# EAGLE design driver (EAGLE 5.11)
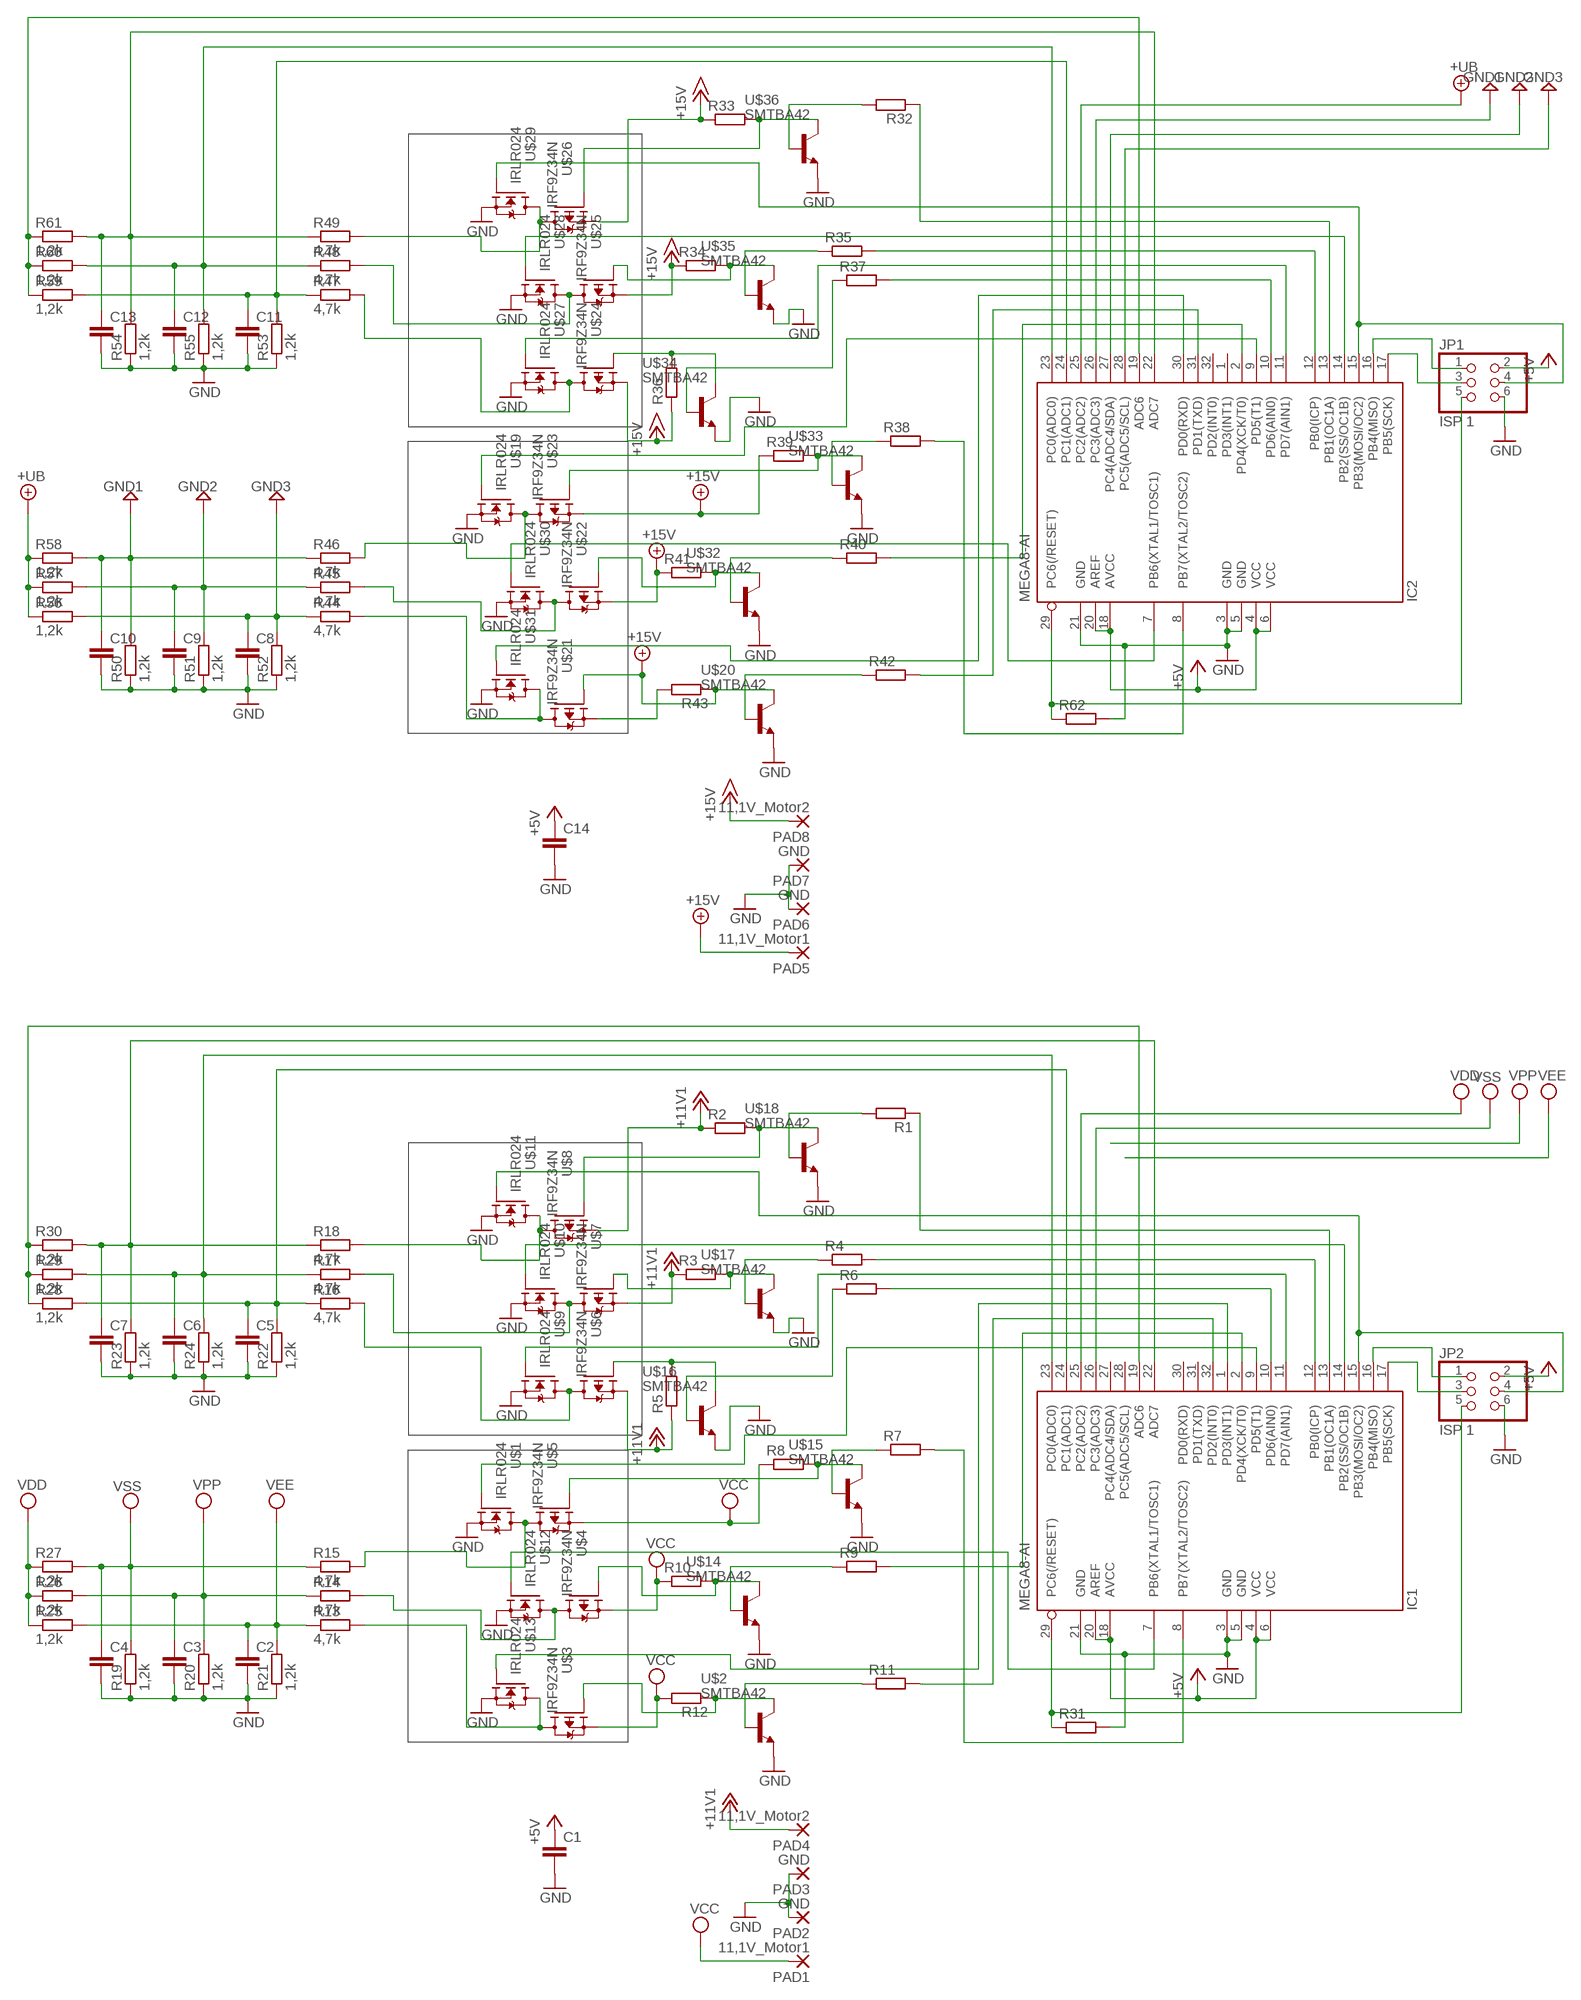
[diagram p0: schematic, sheet 1]

## Parts
C1  C-EUC0805  [C0805]
C2  C-EUC0805  [C0805]
C3  C-EUC0805  [C0805]
C4  C-EUC0805  [C0805]
C5  C-EUC0805  [C0805]
C6  C-EUC0805  [C0805]
C7  C-EUC0805  [C0805]
C8  C-EUC0805  [C0805]
C9  C-EUC0805  [C0805]
C10  C-EUC0805  [C0805]
C11  C-EUC0805  [C0805]
C12  C-EUC0805  [C0805]
C13  C-EUC0805  [C0805]
C14  C-EUC0805  [C0805]
IC1  MEGA8-AI  [TQFP32-08]
IC2  MEGA8-AI  [TQFP32-08]
JP1  ISP 1  PINHD-2X3  [2X03]
JP2  ISP 1  PINHD-2X3  [2X03]
PAD1  11,1V_Motor1  3,17/1,3  [3,17/1,3]
PAD2  GND  3,17/1,3  [3,17/1,3]
PAD3  GND  3,17/1,3  [3,17/1,3]
PAD4  11,1V_Motor2  3,17/1,3  [3,17/1,3]
PAD5  11,1V_Motor1  3,17/1,3  [3,17/1,3]
PAD6  GND  3,17/1,3  [3,17/1,3]
PAD7  GND  3,17/1,3  [3,17/1,3]
PAD8  11,1V_Motor2  3,17/1,3  [3,17/1,3]
R1  R-EU_M0805  [M0805]
R2  R-EU_0204/5  [0204/5]
R3  R-EU_0204/5  [0204/5]
R4  R-EU_M0805  [M0805]
R5  R-EU_0204/5  [0204/5]
R6  R-EU_M0805  [M0805]
R7  R-EU_M0805  [M0805]
R8  R-EU_0204/5  [0204/5]
R9  R-EU_M0805  [M0805]
R10  R-EU_0204/5  [0204/5]
R11  R-EU_M0805  [M0805]
R12  R-EU_0204/5  [0204/5]
R13  4,7k  R-EU_M0805  [M0805]
R14  4,7k  R-EU_M0805  [M0805]
R15  4,7k  R-EU_M0805  [M0805]
R16  4,7k  R-EU_M0805  [M0805]
R17  4,7k  R-EU_M0805  [M0805]
R18  4,7k  R-EU_M0805  [M0805]
R19  1,2k  R-EU_M0805  [M0805]
R20  1,2k  R-EU_M0805  [M0805]
R21  1,2k  R-EU_M0805  [M0805]
R22  1,2k  R-EU_M0805  [M0805]
R23  1,2k  R-EU_M0805  [M0805]
R24  1,2k  R-EU_M0805  [M0805]
R25  1,2k  R-EU_M0805  [M0805]
R26  1,2k  R-EU_M0805  [M0805]
R27  1,2k  R-EU_M0805  [M0805]
R28  1,2k  R-EU_M0805  [M0805]
R29  1,2k  R-EU_M0805  [M0805]
R30  1,2k  R-EU_M0805  [M0805]
R31  R-EU_M0805  [M0805]
R32  R-EU_M0805  [M0805]
R33  R-EU_0204/5  [0204/5]
R34  R-EU_0204/5  [0204/5]
R35  R-EU_M0805  [M0805]
R36  R-EU_0204/5  [0204/5]
R37  R-EU_M0805  [M0805]
R38  R-EU_M0805  [M0805]
R39  R-EU_0204/5  [0204/5]
R40  R-EU_M0805  [M0805]
R41  R-EU_0204/5  [0204/5]
R42  R-EU_M0805  [M0805]
R43  R-EU_0204/5  [0204/5]
R44  4,7k  R-EU_M0805  [M0805]
R45  4,7k  R-EU_M0805  [M0805]
R46  4,7k  R-EU_M0805  [M0805]
R47  4,7k  R-EU_M0805  [M0805]
R48  4,7k  R-EU_M0805  [M0805]
R49  4,7k  R-EU_M0805  [M0805]
R50  1,2k  R-EU_M0805  [M0805]
R51  1,2k  R-EU_M0805  [M0805]
R52  1,2k  R-EU_M0805  [M0805]
R53  1,2k  R-EU_M0805  [M0805]
R54  1,2k  R-EU_M0805  [M0805]
R55  1,2k  R-EU_M0805  [M0805]
R56  1,2k  R-EU_M0805  [M0805]
R57  1,2k  R-EU_M0805  [M0805]
R58  1,2k  R-EU_M0805  [M0805]
R59  1,2k  R-EU_M0805  [M0805]
R60  1,2k  R-EU_M0805  [M0805]
R61  1,2k  R-EU_M0805  [M0805]
R62  R-EU_M0805  [M0805]
U$1  IRLR024  [TO252]
U$2  SMTBA42  [SOT23-BEC]
U$3  IRF9Z34N  [TO220V]
U$4  IRF9Z34N  [TO220V]
U$5  IRF9Z34N  [TO220V]
U$6  IRF9Z34N  [TO220V]
U$7  IRF9Z34N  [TO220V]
U$8  IRF9Z34N  [TO220V]
U$9  IRLR024  [TO252]
U$10  IRLR024  [TO252]
U$11  IRLR024  [TO252]
U$12  IRLR024  [TO252]
U$13  IRLR024  [TO252]
U$14  SMTBA42  [SOT23-BEC]
U$15  SMTBA42  [SOT23-BEC]
U$16  SMTBA42  [SOT23-BEC]
U$17  SMTBA42  [SOT23-BEC]
U$18  SMTBA42  [SOT23-BEC]
U$19  IRLR024  [TO252]
U$20  SMTBA42  [SOT23-BEC]
U$21  IRF9Z34N  [TO220V]
U$22  IRF9Z34N  [TO220V]
U$23  IRF9Z34N  [TO220V]
U$24  IRF9Z34N  [TO220V]
U$25  IRF9Z34N  [TO220V]
U$26  IRF9Z34N  [TO220V]
U$27  IRLR024  [TO252]
U$28  IRLR024  [TO252]
U$29  IRLR024  [TO252]
U$30  IRLR024  [TO252]
U$31  IRLR024  [TO252]
U$32  SMTBA42  [SOT23-BEC]
U$33  SMTBA42  [SOT23-BEC]
U$34  SMTBA42  [SOT23-BEC]
U$35  SMTBA42  [SOT23-BEC]
U$36  SMTBA42  [SOT23-BEC]

## Nets
+5V: C1.1 C14.1 IC1.4(VCC) IC1.6(VCC) IC1.18(AVCC) IC1.20(AREF) IC2.4(VCC) IC2.6(VCC) IC2.18(AVCC) IC2.20(AREF) JP1.2 JP2.2
+12V: PAD4.1(P) R2.1 R3.1 R5.1 U$6.3(S) U$7.3(S) U$8.3(S) ; supply symbol labelled +11V1
+15V: PAD5.1(P) PAD8.1(P) R33.1 R34.1 R36.1 R39.1 R41.1 R43.1 U$20.C U$21.1(G) U$22.3(S) U$23.3(S) U$24.3(S) U$25.3(S) U$26.3(S)
+UB: IC2.25(PC2(ADC2)) R56.1 R57.1 R58.1
GND: C1.2 C2.2 C3.2 C4.2 C5.2 C6.2 C7.2 C8.2 C9.2 C10.2 C11.2 C12.2 C13.2 C14.2 IC1.3(GND) IC1.5(GND) IC1.21(GND) IC2.3(GND) IC2.5(GND) IC2.21(GND) JP1.6 JP2.6 PAD2.1(P) PAD3.1(P) PAD6.1(P) PAD7.1(P) R19.1 R20.1 R21.1 R22.1 R23.1 R24.1 R31.2 R50.1 R51.1 R52.1 R53.1 R54.1 R55.1 R62.2 U$1.2(S) U$2.E U$9.2(S) U$10.2(S) U$11.2(S) U$12.2(S) U$13.2(S) U$14.E U$15.E U$16.E U$17.E U$18.E U$19.2(S) U$20.E U$27.2(S) U$28.2(S) U$29.2(S) U$30.2(S) U$31.2(S) U$32.E U$33.E U$34.E U$35.E U$36.E
GND1: C10.1 IC2.26(PC3(ADC3)) R46.1 R50.2 R58.2
GND2: C9.1 IC2.27(PC4(ADC4/SDA)) R45.1 R51.2 R57.2
GND3: C8.1 IC2.28(PC5(ADC5/SCL)) R44.1 R52.2 R56.2
N$1: R16.2 U$6.2(D) U$9.3(D)
N$2: IC1.16(PB4(MISO)) JP2.1
N$3: C5.1 IC1.24(PC1(ADC1)) R16.1 R22.2 R28.2
N$4: IC1.15(PB3(MOSI/OC2)) JP2.4 U$11.1(G)
N$5: IC1.14(PB2(SS/OC1B)) U$10.1(G)
N$6: IC1.13(PB1(OC1A)) R1.1
N$7: R12.1 U$2.C U$3.1(G)
N$8: R8.2 U$5.1(G) U$15.C
N$9: R10.2 U$4.1(G) U$14.C
N$10: R9.1 U$14.B
N$11: C6.1 IC1.23(PC0(ADC0)) R17.1 R24.2 R29.2
N$12: C7.1 IC1.22(ADC7) R18.1 R23.2 R30.2
N$13: R7.1 U$15.B
N$14: IC1.8(PB7(XTAL2/TOSC2)) R7.2
N$15: IC1.19(ADC6) R28.1 R29.1 R30.1
N$16: R47.2 U$24.2(D) U$27.3(D)
N$17: R2.2 U$8.1(G) U$18.C
N$18: R1.2 U$18.B
N$19: R18.2 U$8.2(D) U$11.3(D)
N$20: R17.2 U$7.2(D) U$10.3(D)
N$21: IC1.11(PD7(AIN1)) U$9.1(G)
N$22: IC1.12(PB0(ICP)) R4.2
N$23: IC1.10(PD6(AIN0)) R6.2
N$24: R13.2 U$3.2(D) U$13.3(D)
N$25: IC1.9(PD5(T1)) U$1.1(G)
N$26: R3.2 U$7.1(G) U$17.C
N$27: IC1.7(PB6(XTAL1/TOSC1)) U$12.1(G)
N$28: R15.2 U$1.3(D) U$5.2(D)
N$29: R14.2 U$4.2(D) U$12.3(D)
N$30: IC1.2(PD4(XCK/T0)) R9.2
N$31: IC1.1(PD3(INT1)) U$13.1(G)
N$32: IC1.32(PD2(INT0)) R11.2
N$33: R4.1 U$17.B
N$34: R5.2 U$6.1(G) U$16.C
N$35: R6.1 U$16.B
N$36: R11.1 U$2.B
N$38: IC2.15(PB3(MOSI/OC2)) JP1.4 U$29.1(G)
N$39: IC2.13(PB1(OC1A)) R32.1
N$40: IC1.17(PB5(SCK)) JP2.3
N$41: IC2.14(PB2(SS/OC1B)) U$28.1(G)
N$42: IC1.29(PC6(/RESET)) JP2.5 R31.1
N$43: R49.2 U$26.2(D) U$29.3(D)
N$44: R48.2 U$25.2(D) U$28.3(D)
N$45: IC2.11(PD7(AIN1)) U$27.1(G)
N$46: R44.2 U$21.2(D) U$31.3(D)
N$47: IC2.9(PD5(T1)) U$19.1(G)
N$48: IC2.7(PB6(XTAL1/TOSC1)) U$30.1(G)
N$49: R46.2 U$19.3(D) U$23.2(D)
N$50: R45.2 U$22.2(D) U$30.3(D)
N$52: R41.2 U$22.1(G) U$32.C
N$53: R40.1 U$32.B
N$54: R39.2 U$23.1(G) U$33.C
N$55: R38.1 U$33.B
N$56: R33.2 U$26.1(G) U$36.C
N$57: R32.2 U$36.B
N$58: IC2.12(PB0(ICP)) R35.2
N$59: IC2.10(PD6(AIN0)) R37.2
N$60: R34.2 U$25.1(G) U$35.C
N$61: R35.1 U$35.B
N$62: R36.2 U$24.1(G) U$34.C
N$63: R37.1 U$34.B
N$64: R42.1 U$20.B
N$65: IC2.2(PD4(XCK/T0)) R40.2
N$66: C11.1 IC2.24(PC1(ADC1)) R47.1 R53.2 R59.2
N$67: C12.1 IC2.23(PC0(ADC0)) R48.1 R55.2 R60.2
N$68: C13.1 IC2.22(ADC7) R49.1 R54.2 R61.2
N$69: IC2.19(ADC6) R59.1 R60.1 R61.1
N$70: IC2.29(PC6(/RESET)) JP1.5 R62.1
N$71: IC2.16(PB4(MISO)) JP1.1
N$72: IC2.17(PB5(SCK)) JP1.3
N$73: IC2.30(PD0(RXD)) U$31.1(G)
N$74: IC2.31(PD1(TXD)) R42.2
N$75: IC2.8(PB7(XTAL2/TOSC2)) R38.2
N$78: R43.2 U$21.3(S)
VCC: PAD1.1(P) R8.1 R10.1 R12.2 U$3.3(S) U$4.3(S) U$5.3(S)
VDD: IC1.25(PC2(ADC2)) R25.1 R26.1 R27.1
VEE: C2.1 R13.1 R21.2 R25.2
VPP: C3.1 R14.1 R20.2 R26.2
VSS: C4.1 IC1.26(PC3(ADC3)) R15.1 R19.2 R27.2
Unconnected: IC1.27(PC4(ADC4/SDA)) IC1.28(PC5(ADC5/SCL)) IC1.30(PD0(RXD)) IC1.31(PD1(TXD)) IC2.1(PD3(INT1)) IC2.32(PD2(INT0))

## Library data of the parts
C1-C14 = rcl:C-EU: CAPACITOR, European symbol
IC1 IC2 = atmel:MEGA8: MICROCONTROLLER 8 Kbytes FLASH, 1 kbytes SRAM, 512 bytes EEPROM, USART, 6-channel 10 bit ADC, 2-channel 8 bit ADC Pin compatible with Atmega48, ATMega88, ATMega168 Source: avr.lbr; MPN: ATMEGA8-16AU; OC_FARNELL: 9171371; OC_NEWARK: 73M8863
JP1 JP2 = pinhead:PINHD-2X3: PIN HEADER
PAD1-PAD8 = wirepad:3,17/1,3: THROUGH-HOLE PAD
R1-R62 = rcl:R-EU_: RESISTOR, European symbol
U$1 U$9-U$13 U$19 U$27-U$31 = transistor-fet:IRLR024: MOSFET - by AlKi
U$2 U$14-U$18 U$20 U$32-U$36 = transistor-npn:SMTBA42
U$3-U$8 U$21-U$26 = transistor-fet:IRF9Z34N

## Board
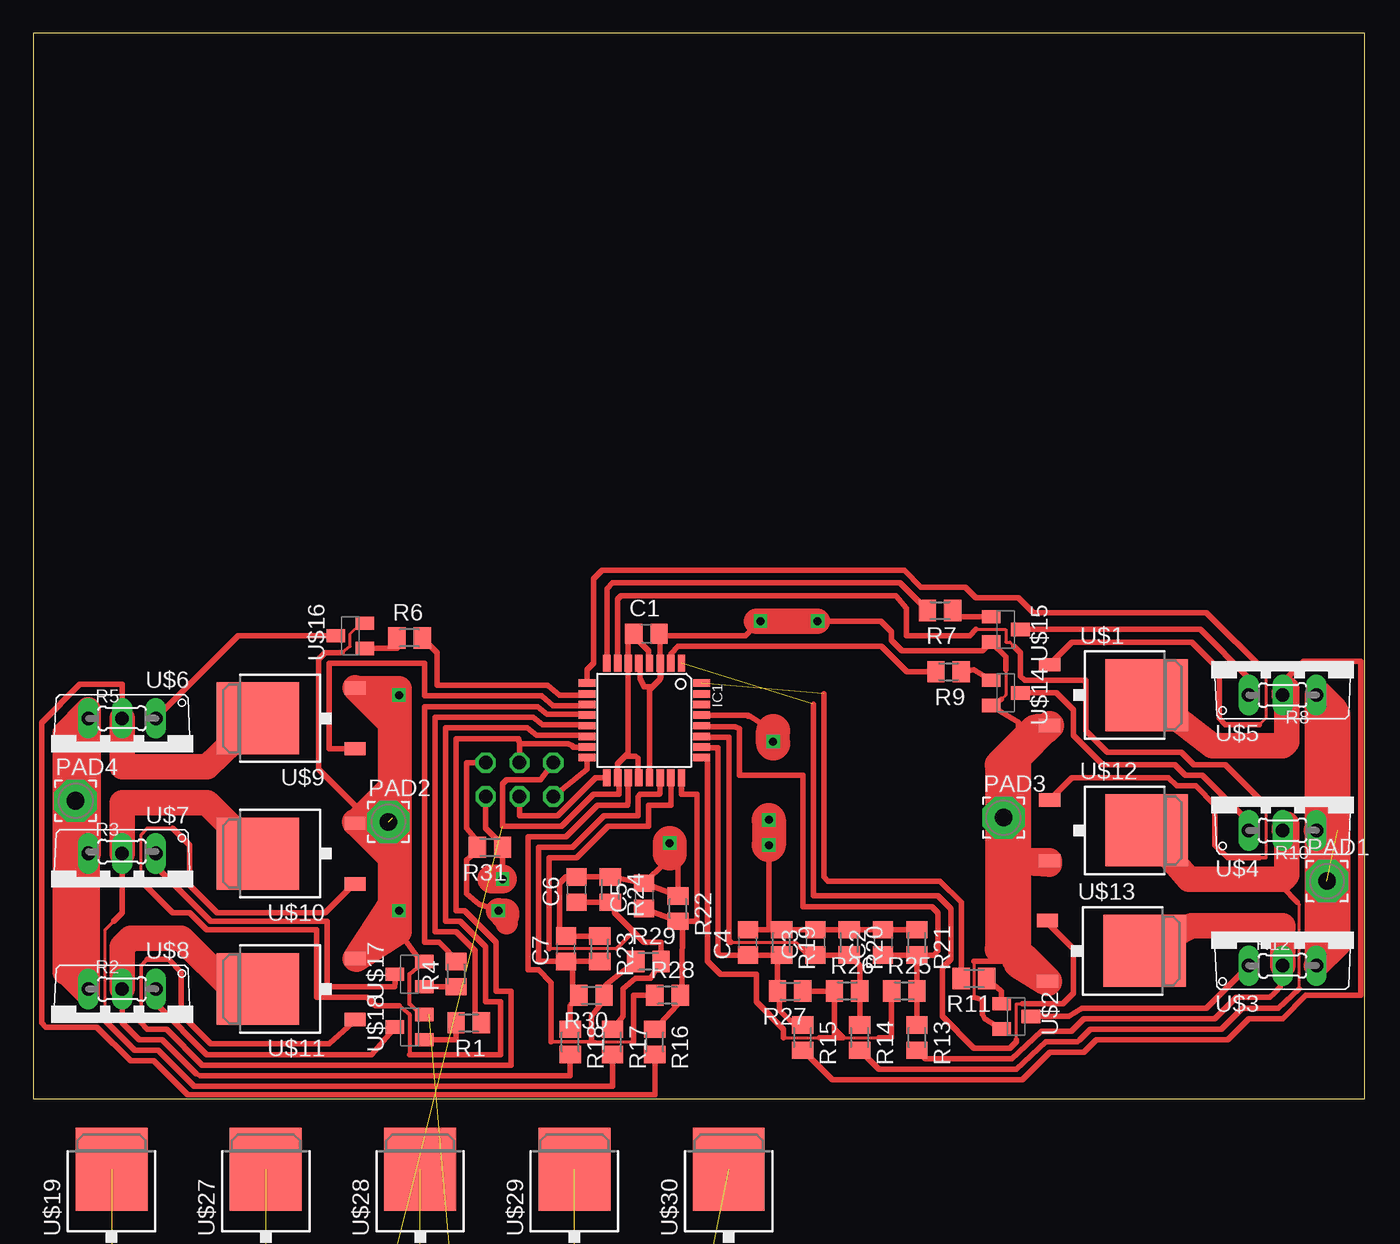
[diagram p1: board, top side]
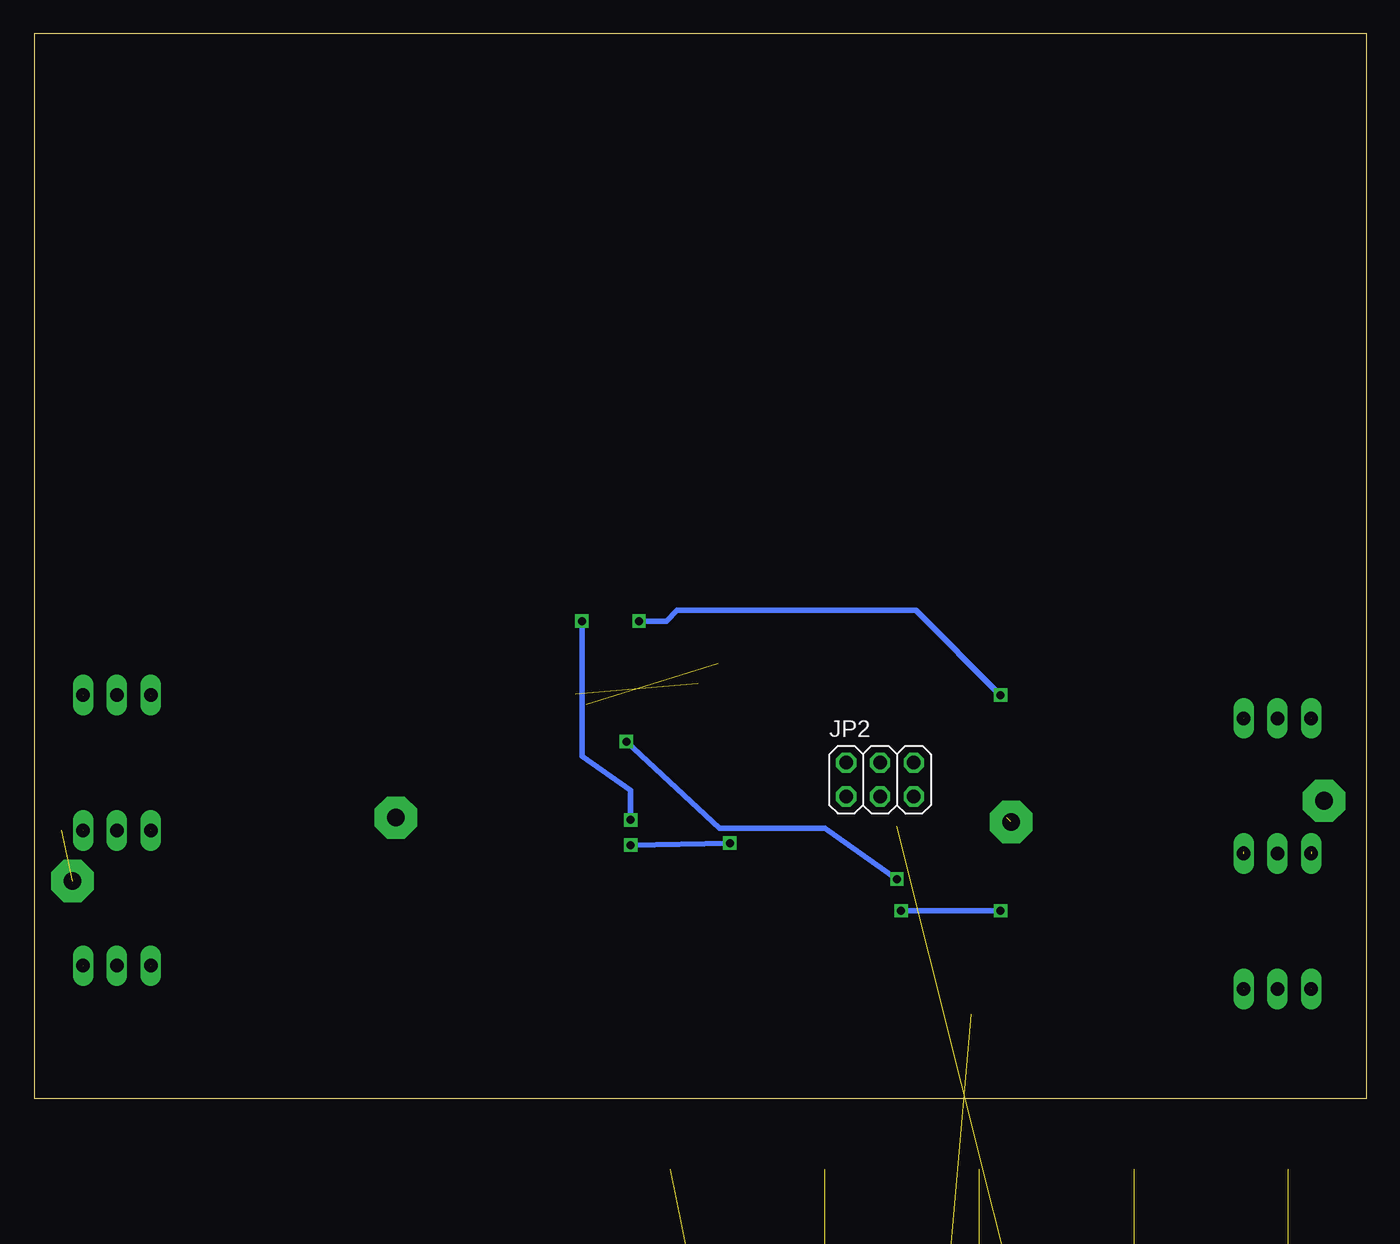
[diagram p2: board, bottom side, seen from below]

Size 100 x 80 mm. Coordinates in mm from the lower left corner, seen from the top.
Outline: 0,0 100,0 100,80 0,80 0,0
Copper layers (1*16): Top 0.035mm / dielectric 1.5mm / Bottom 0.035mm
Design rules "default": minimum track width 10mil, minimum drill 24mil, track to track 8mil, track to pad 8mil, pad to pad 8mil, via to via 8mil, smd to smd 8mil, copper to edge 40mil, drill to drill 8mil, minimum pad ring 10mil, minimum via ring 8mil, stop-mask expansion 4mil, vias tented up to drill 0mil, thermal gap 10mil

### Footprints (pad centres in the part's own frame; a part is rotated, then mirrored left to right if it is on the bottom)
C0805 = smd 1.3 x 1.5: 1 -0.95,0; 2 0.95,0
TQFP32-08 = smd 1.27 x 0.559: 1 -4.293,2.8; 2 -4.293,2; 3 -4.293,1.2; 4 -4.293,0.4; 5 -4.293,-0.4; 6 -4.293,-1.2; 7 -4.293,-2; 8 -4.293,-2.8; 17 4.293,-2.8; 18 4.293,-2; 19 4.293,-1.2; 20 4.293,-0.4; 21 4.293,0.4; 22 4.293,1.2; 23 4.293,2; 24 4.293,2.8 | smd 0.559 x 1.27: 9 -2.8,-4.293; 10 -2,-4.293; 11 -1.2,-4.293; 12 -0.4,-4.293; 13 0.4,-4.293; 14 1.2,-4.293; 15 2,-4.293; 16 2.8,-4.293; 25 2.8,4.293; 26 2,4.293; 27 1.2,4.293; 28 0.4,4.293; 29 -0.4,4.293; 30 -1.2,4.293; 31 -2,4.293; 32 -2.8,4.293
2X03 = drill 1.016 octagon: 1 -2.54,-1.27; 2 -2.54,1.27; 3 0,-1.27; 4 0,1.27; 5 2.54,-1.27; 6 2.54,1.27
3,17/1,3 = drill 1.321 pad 3.175 octagon: 1 0,0
M0805 = smd 1.3 x 1.6: 1 -0.95,0; 2 0.95,0
0204/5 = drill 0.813 octagon: 1 -2.54,0; 2 2.54,0
TO252 = smd 1 x 1.6: 1 -2.28,-4.8; 2 2.28,-4.8 | smd 5.4 x 6.2: 3 0,2.5
SOT23-BEC = smd 1 x 1.4: B -0.95,-1.1; C 0,1.1; E 0.95,-1.1
TO220V = drill 1.016 long: 1 -2.54,-2.54; 2 0,-2.54; 3 2.54,-2.54

### Placement (x,y rotation side)
C1  46.04,34.92 0 top
C2  63.82,11.75 90 top
C3  58.74,11.75 90 top
C4  53.66,11.75 90 top
C5  45.88,15.24 90 top
C6  40.8,15.72 90 top
C7  40.01,11.27 90 top
C8  8.41,-74.14 0 top  (outside the outline)
C9  13.34,-74.14 0 top  (outside the outline)
C10  57.94,-62.39 0 top  (outside the outline)
C11  2.54,-69.06 0 top  (outside the outline)
C12  8.41,-69.06 0 top  (outside the outline)
C13  14.29,-69.06 0 top  (outside the outline)
C14  20.16,-69.06 0 top  (outside the outline)
IC1  45.88,28.42 270 top
IC2  17.3,-20.95 0 top  (outside the outline)
JP1  28.1,-19.37 0 top  (outside the outline)
JP2  36.51,23.97 0 bottom
PAD1  97.16,16.35 0 top
PAD2  26.67,20.8 0 top
PAD3  72.87,21.11 0 top
PAD4  3.18,22.38 0 top
PAD5  51.75,-41.59 0 top  (outside the outline)
PAD6  2.54,-49.85 0 top  (outside the outline)
PAD7  9.21,-49.85 0 top  (outside the outline)
PAD8  15.88,-49.85 0 top  (outside the outline)
R1  32.7,5.72 180 top
R2  6.67,8.26 0 top
R3  6.67,18.57 0 top
R4  31.75,9.37 90 top
R5  6.67,28.57 0 top
R6  28.26,34.61 0 top
R7  68.1,36.67 180 top
R8  93.82,30.32 180 top
R9  68.74,32.07 180 top
R10  93.82,20.16 180 top
R11  70.64,9.05 180 top
R12  93.82,10 0 top
R13  66.36,4.6 270 top
R14  62.07,4.6 270 top
R15  57.78,4.6 270 top
R16  46.67,4.29 270 top
R17  43.5,4.29 270 top
R18  40.32,4.29 270 top
R19  56.2,11.75 270 top
R20  61.28,11.75 270 top
R21  66.36,11.75 270 top
R22  48.42,14.29 270 top
R23  42.55,11.27 270 top
R24  43.34,15.72 270 top
R25  65.4,8.1 0 top
R26  61.12,8.1 0 top
R27  56.83,8.1 180 top
R28  47.62,7.78 0 top
R29  46.2,10.32 0 top
R30  41.91,7.78 180 top
R31  34.29,18.89 180 top
R32  26.04,-69.06 0 top  (outside the outline)
R33  10,-62.39 0 top  (outside the outline)
R34  18.26,-62.39 0 top  (outside the outline)
R35  31.91,-69.06 0 top  (outside the outline)
R36  26.51,-62.39 0 top  (outside the outline)
R37  37.62,-69.06 0 top  (outside the outline)
R38  43.5,-69.06 0 top  (outside the outline)
R39  34.77,-62.39 0 top  (outside the outline)
R40  49.37,-69.06 0 top  (outside the outline)
R41  43.02,-62.39 0 top  (outside the outline)
R42  55.09,-69.06 0 top  (outside the outline)
R43  51.28,-62.39 0 top  (outside the outline)
R44  22.54,-49.05 0 top  (outside the outline)
R45  28.42,-49.05 0 top  (outside the outline)
R46  34.29,-49.05 0 top  (outside the outline)
R47  40.16,-49.05 0 top  (outside the outline)
R48  46.04,-49.05 0 top  (outside the outline)
R49  51.91,-49.05 0 top  (outside the outline)
R50  57.78,-49.05 0 top  (outside the outline)
R51  2.54,-55.72 0 top  (outside the outline)
R52  8.41,-55.72 0 top  (outside the outline)
R53  14.29,-55.72 0 top  (outside the outline)
R54  20.16,-55.72 0 top  (outside the outline)
R55  26.04,-55.72 0 top  (outside the outline)
R56  31.91,-55.72 0 top  (outside the outline)
R57  37.78,-55.72 0 top  (outside the outline)
R58  43.66,-55.72 0 top  (outside the outline)
R59  49.53,-55.72 0 top  (outside the outline)
R60  55.4,-55.72 0 top  (outside the outline)
R61  2.54,-62.39 0 top  (outside the outline)
R62  2.54,-74.14 0 top  (outside the outline)
U$1  81.12,30.32 270 top
U$2  73.82,6.19 270 top
U$3  93.82,12.54 0 top
U$4  93.82,22.7 0 top
U$5  93.82,32.86 0 top
U$6  6.67,26.04 180 top
U$7  6.67,15.88 180 top
U$8  6.67,5.72 180 top
U$9  19.37,28.58 90 top
U$10  19.37,18.42 90 top
U$11  19.37,8.26 90 top
U$12  81.12,20.16 270 top
U$13  80.96,11.11 270 top
U$14  73.03,30.48 270 top
U$15  73.03,35.24 270 top
U$16  23.81,34.77 90 top
U$17  28.26,9.37 90 top
U$18  28.26,5.4 90 top
U$19  5.87,-7.78 0 top  (outside the outline)
U$20  48.9,-31.59 0 top  (outside the outline)
U$21  37.94,-16.03 0 top  (outside the outline)
U$22  49.53,-16.03 0 top  (outside the outline)
U$23  5.87,-29.21 0 top  (outside the outline)
U$24  17.46,-29.21 0 top  (outside the outline)
U$25  29.05,-29.21 0 top  (outside the outline)
U$26  40.64,-29.21 0 top  (outside the outline)
U$27  17.46,-7.78 0 top  (outside the outline)
U$28  29.05,-7.78 0 top  (outside the outline)
U$29  40.64,-7.78 0 top  (outside the outline)
U$30  52.23,-7.78 0 top  (outside the outline)
U$31  5.71,-20.95 0 top  (outside the outline)
U$32  2.54,-41.59 0 top  (outside the outline)
U$33  12.38,-41.59 0 top  (outside the outline)
U$34  22.23,-41.59 0 top  (outside the outline)
U$35  32.07,-41.59 0 top  (outside the outline)
U$36  41.91,-41.59 0 top  (outside the outline)

### Tracks (layer width: path | path; a pad name or v marks a point on that pad's centre or on a via)
+5V  (via drill 0.6)  (6 unrouted)
  Top 0.406: 44.45,25.72 43.88,25.15 IC1.18 43.97,24.03 43.97,22.86 42.07,22.86 39.69,20.48 35.24,20.48 35.24,23.65 35.56,23.97 38.1,23.97 JP2.2 | 44.45,25.72 45.24,25.72 45.4,25.56 45.4,24.2 IC1.20 | 44.45,25.72 44.68,25.95 IC1.6 44.68,34.52 C1.1 45.09,34.76 46.2,33.66 46.2,32.79 IC1.4 | JP2.2
  other vias: 39.05,25.24
+12V  (3 unrouted)
  Top 0.406: PAD4.1 2.38,21.59 2.38,19.68
  Top 1.778: U$8.3 U$7.3 | 2.38,10 U$8.3 | U$8.3 4.13,7.78 2.38,9.53
  Top 1.93: 2.38,26.83 R5.1 U$7.3 2.54,18.41 2.38,18.57 | 2.38,18.57 2.38,19.68 2.38,26.83 | 2.38,18.57 2.38,10 | 2.38,9.53 2.38,18.57 | 2.38,26.83 2.38,27.46 4.13,29.21 4.13,28.89
+15V  (14 unrouted)
+UB  (3 unrouted)
GND  (via drill 0.6)  (33 unrouted)
  Top 0.22: 23.18,33.5 23.81,33.97 23.81,34.92 24.6,35.72 U$16.E | 70.64,10.32 70.64,7.62 | 72.71,30 73.03,30.32 73.03,32.23
  Top 0.305: U$18.E 29.68,6.35 | U$9.2 23.81,30.86 | U$17.E 28.26,9.38 28.26,7.14 28.88,6.52
  Top 0.406: C5.2 R22.1 48.42,17.78 47.78,18.41 | C5.2 R24.1 C6.2 40,16.67 39.53,16.19 39.53,12.7 C7.2 R23.1 | IC1.21 46.28,30.72 46.51,30.96 | 47.08,31.52 47.15,31.75 47.15,32.64 IC1.3 | IC1.3 47.08,31.52 | 47.08,31.52 46.51,30.96 | 46.51,30.96 45.88,30.96 45.56,31.59 45.56,32.47 IC1.5 | IC1.3 47.08,34.83 C1.2 47.15,34.77 53.5,34.77 v54.61,35.88 | 27.46,12.54 28.74,10.79 U$17.E | U$18.E 28.88,6.52 | U$9.2 26.99,30.86 26.99,21.11 25.08,21.11 21.43,24.77 21.43,33.02 21.91,33.5 23.18,33.5 | U$2.E 71.45,6.03 71.28,6.35 71.28,7.46 70.64,7.62 | 73.98,10.32 70.64,10.32 | C5.2 47.47,17.78 | R21.1 R20.1 | R20.1 C2.2 | R20.1 C3.2 R19.1 55.56,12.7 | 55.56,12.7 C4.2 | 73.98,25.56 73.98,28.27 U$14.E 72.08,29.54 72.71,30 | 73.03,32.23 73.03,33.19 U$15.E 71.29,33.66 65.25,33.66 64.45,34.45 64.45,35.08 63.66,35.88 v58.9,35.88 | 35.4,13.97 33.5,14.61 32.54,15.4 32.54,17.94 33.34,18.57 R31.2 33.34,19.36 32.54,20.32 32.54,25.24 32.7,25.24 JP2.6 | JP2.6 | 55.56,12.7 55.24,13.02 v55.24,19.05 | v34.92,14.13
  Top 1.676: 35.4,13.81 35.56,13.18
  Top 1.93: 73.98,10.26 73.98,10.32 73.98,17.78 76.32,17.62 U$12.2 73.98,17.88 73.98,25.56 76.32,27.94 U$1.2 | U$9.2 26.83,28.19 26.83,23.36 U$10.2 27.46,20.7 | 27.46,20.7 v27.46,30.32 27.46,30.8 24.45,30.8 | v27.46,14.13 27.46,13.83 U$11.2 26.83,14.62 26.83,20 26.04,20.8 24.13,20.8 27.46,17.46 v27.46,14.13 | v27.46,14.13 27.46,20.7 | v27.46,14.13 27.46,12.54 24.29,10.48 | v34.92,14.13 35.4,13.97 | v58.9,35.88 v54.61,35.88 54.29,35.88 | v55.24,19.05
  Top 2.184: 35.4,13.97 35.4,13.81 | 72.55,20.8 arc-90 PAD3.1 | 72.55,20.8 72.55,11.27 | 72.55,20.8 72.55,25.08 75.25,27.78 76.06,27.78 U$1.2 | 73.98,10.26 73.98,10.16 76.04,8.89 74.3,10.16 | 74.3,10.16 73.82,10.48 | 74.3,10.16 75.25,9.53 74.14,10.64 74.36,10.64 U$13.2
  Top 2.54: v55.24,20.95 v55.24,19.05 | v47.78,19.21 47.78,18.41
  Bottom 0.406: v27.46,14.13 v34.92,14.13 | v55.24,20.95 55.24,23.18 58.9,25.72 v58.9,35.88 | v55.24,19.05 v47.78,19.21 | v55.24,19.05 | v54.61,35.88 52.55,35.88 51.75,36.67 33.81,36.67 v27.46,30.32
  other vias: 33.97,25.24
GND1  (4 unrouted)
GND2  (4 unrouted)
GND3  (4 unrouted)
N$1
  Top 0.406: 6.67,24.92 6.67,31.11 3.49,31.11 0.64,28.26 0.64,5.71 0.95,5.4 4.76,5.4 7.3,2.86 9.05,2.86 11.59,0.32 28.42,0.32 46.67,0.32 R16.2
  Top 1.93: U$9.3 13.06,24.92 6.67,24.92 U$6.2
N$2  (via drill 0.6)
  Top 0.406: IC1.16 41.59,24.76 JP2.1 v39.05,22.76
N$3
  Top 0.406: R16.1 48.74,7.46 R28.2 48.73,7.78 48.74,9.21 | 48.74,9.21 | 48.74,9.21 48.74,13.34 | 48.74,13.34 R22.2 C5.1 | 48.74,13.34 49.85,13.34 49.85,22.86 48.68,22.86 IC1.24
N$4
  Top 0.254: 8.1,5.71 8.1,10
  Top 0.305: 8.1,10 8.57,10.48
  Top 0.406: U$11.1 24.17,5.71 23.97,5.71 22.23,4.13 13.34,4.13 11.11,6.35 11.11,9.53 10.16,10.48 8.57,10.48 | 8.1,5.71 8.57,5.24 10,5.24 12.7,2.54 35.88,2.54 35.88,8.1 34.77,8.1 34.77,11.75 32.38,14.13 31.75,14.13 31.75,27.06 36.44,27.06 36.51,26.67 | IC1.15 40.55,26.42 40.48,26.51 40.16,26.67 36.51,26.67 | 36.51,26.67 JP2.4
N$5
  Top 0.22: 8.1,16.35 8.1,19.84
  Top 0.254: 8.1,19.84 8.57,20.32
  Top 0.305: 8.57,20.32 10.48,20.32 | 27.46,6.99 28.26,6.35 28.26,3.33
  Top 0.406: U$10.1 24.07,16.14 21.91,13.97 13.81,13.97 11.75,16.03 11.75,19.05 10.48,20.32 | 8.1,16.35 10.48,13.97 11.75,13.97 13.02,12.7 21.27,12.7 21.27,7.62 25.08,7.62 25.72,6.99 27.46,6.99 | 28.26,3.33 35.08,3.33 35.08,7.3 33.97,7.3 33.97,11.43 32.07,13.34 30.96,13.34 30.96,27.86 37.07,27.86 37.78,27.3 41.5,27.3 IC1.14
N$6
  Top 0.406: R1.1 33.18,5.71 33.18,11.11 | 33.18,11.11 | 33.18,11.11 31.75,12.54 30.16,12.54 30.16,28.66 37.54,28.66 38.26,28.1 41.5,28.1 IC1.13
N$7  (1 unrouted)
  Top 0.406: U$3.1 88.11,6.83 78.74,6.83 77.79,6.19 | U$2.C 76.99,6.19 | 76.99,6.19 | 76.99,6.19 77.79,6.19 | 76.99,6.19 77.79,6.19
N$8  (1 unrouted)
  Top 0.406: U$5.1 91.28,31.59 87.63,35.24 U$15.C
N$9  (1 unrouted)
  Top 0.406: U$4.1 91.28,20.8 87.79,24.29 86.52,24.29 85.72,25.08 80.33,25.08 78.11,27.3 78.11,29.21 76.83,30.48 74.44,30.48 U$14.C
N$10
  Top 0.406: U$14.B 70.64,32.22 R9.1
N$11
  Top 0.22: 43.81,11.27 38.73,11.27
  Top 0.305: 45.09,12.54 43.81,11.27
  Top 0.406: R17.1 44.29,6.19 44.29,8.26 45.24,9.05 46.35,9.05 R29.2 47.15,11.75 45.88,11.75 43.66,13.97 | 43.66,13.97 43.66,14.76 | 43.66,14.76 R24.2 C6.1 41.12,14.76 43.66,14.76 | 43.66,13.97 45.09,12.54 | IC1.23 47.88,22.07 46.2,22.07 46.2,20.48 43.18,20.48 40.8,18.1 38.73,18.1 38.73,11.27
N$12
  Top 0.406: R18.1 40.32,6.99 R30.2 | R30.2 | R30.2 41.12,7.78 | 41.12,7.78 40.8,7.78 | 41.12,7.78 40.48,7.78 40.48,10.16 40.64,10.32 R23.2 C7.1 37.94,10.32 37.94,13.49 37.94,13.65 37.94,13.97 37.94,14.13 37.94,18.89 40.48,18.89 42.86,21.27 45.4,21.27 45.4,22.7 45.56,22.86 46.99,22.86 47.08,22.95 IC1.22
N$13
  Top 0.406: U$15.B 69.53,36.19 R7.1
N$14
  Top 0.406: R7.2 65.09,38.73 43.5,38.73 43.08,38.32 IC1.8
N$15
  Top 0.22: 42.22,4.29 45.09,4.29
  Top 0.254: 41.91,4.29 42.22,4.29 41.91,4.29 41.12,4.29 38.89,4.29
  Top 0.406: R29.1 43.81,9.21 43.02,8.57 R30.1 42.54,6.99 41.91,6.19 41.91,4.29 | R28.1 46.51,7.78 45.09,7.78 | 45.09,4.29 45.09,7.78 | 45.09,7.78 | 38.89,4.29 38.89,8.73 37.94,9.68 37.15,9.68 37.15,13.81 37.15,14.45 37.15,19.68 37.62,19.68 40.01,19.68 42.39,22.07 44.61,22.07 44.68,22.31 IC1.19
N$16  (2 unrouted)
N$17  (1 unrouted)
  Top 0.406: U$18.C 25.4,3.33 13.02,3.33 9.37,6.99 U$8.1
N$18
  Top 0.406: R1.2 31.75,4.45 U$18.B
N$19
  Top 0.406: U$8.2 6.67,5.71 7.94,4.45 9.68,4.44 12.22,1.91 12.54,1.75 12.7,1.75 40.32,1.75 R18.2
  Top 1.93: U$11.3 14.92,8.26 11.11,12.06 7.3,12.06 6.67,11.43 U$8.2
N$20
  Top 0.22: 5.4,6.35 5.4,12.7
  Top 0.254: 5.4,12.7 6.03,13.34
  Top 0.406: 6.67,22.23 6.67,13.97 6.03,13.34 | R17.2 43.5,0.95 28.42,0.95 12.06,0.95 9.37,3.65 7.62,3.65 5.4,5.87 5.4,6.35
  Top 1.93: U$10.3 13.06,22.23 6.67,22.23 U$7.2
N$21
  Top 0.406: U$9.1 22.23,26.3 22.23,32.7 29.37,32.7 29.37,30.26 38.16,30.26 39.05,29.53 41.5,29.53 IC1.11
N$22
  Top 0.406: R4.2 31.91,10.32 30.48,11.75 29.37,11.75 29.37,29.46 37.85,29.46 38.58,28.89 41.51,28.89 IC1.12
N$23
  Top 0.406: R6.2 30.32,33.5 30.32,31.06 38.63,31.06 39.53,30.32 41.49,30.32 IC1.10
N$24
  Top 0.406: R13.2 66.99,3.02 73.5,3.02 75.72,5.08 77.95,5.08 78.9,6.03 88.74,6.03 90.33,7.62 92.87,7.62 93.19,7.94 | 93.19,7.94 | 93.19,7.94 93.66,8.41 93.66,9.84 U$3.2
  Top 1.93: U$13.3 86.95,13.02 93.82,13.02 U$3.2
N$25
  Top 0.22: 92.08,28.1 92.55,28.57 92.55,32.07
  Top 0.406: U$1.1 78.01,34.29 87,34.29 89.06,32.23 89.06,28.57 89.53,28.1 92.08,28.1 | 92.55,32.07 88.11,36.51 75.09,36.51 73.98,37.62 70.8,37.62 70.01,38.42 66.67,38.42 65.41,39.69 42.7,39.69 42.07,39.05 42.07,32.7 41.59,32.22 IC1.9
N$26  (1 unrouted)
  Top 0.406: U$17.C 27.16,8.74 27.15,8.41 22.07,8.41 22.07,13.34 13.34,13.34 9.21,17.46 U$7.1
N$27
  Top 0.22: 92.55,22.07 92.55,18.1 | 73.66,33.97 73.34,34.29 73.03,34.29 73.03,35.24 70.8,35.24
  Top 0.254: 92.55,18.1 92.08,18.1
  Top 0.406: U$12.1 78.01,24.13 85.25,24.13 85.88,23.5 87.31,23.5 88.74,22.07 88.74,19.05 89.69,18.1 92.08,18.1 | 92.55,22.07 89.53,25.08 87.15,25.08 86.2,26.04 80.64,26.04 79.06,27.62 79.06,31.43 74.45,31.43 74.14,31.75 74.14,33.5 73.66,33.97 | 73.66,33.97 | 70.8,35.24 70.33,34.77 65.56,34.77 65.56,36.83 64.77,37.78 44.13,37.78 43.88,37.53 IC1.7
N$28
  Top 0.406: U$5.2 93.82,31.27 95.41,32.86 99.69,32.86 99.69,7.78 95.57,7.78 93.82,6.03 91.28,6.03 89.69,4.45 79.85,4.45 78.9,3.49 76.36,3.49 74.3,1.43 60.01,1.43 R15.2
  Top 1.676: 94.14,30.8 93.82,30.48 U$5.2
  Top 1.93: U$1.3 88.54,26.51 93.82,26.51 94.14,26.83 94.14,30.8
N$29
  Top 0.22: 94.93,14.76 95.09,14.61 95.09,8.26
  Top 0.406: 93.82,16.51 93.82,15.88 94.93,14.76 | R14.2 63.5,2.22 73.82,2.22 76.04,4.29 78.42,4.29 78.58,4.45 79.38,5.24 89.22,5.24 90.81,6.83 93.5,6.83 95.09,8.26
  Top 1.676: 94.14,20.64 93.82,20.32 U$4.2
  Top 1.93: U$12.3 86.8,16.51 93.82,16.51 94.14,16.83 94.14,20.64
N$30
  Top 0.406: IC1.2 47.88,33.43 48.42,33.97 63.7,33.97 65.61,32.07 R9.2
N$31  (1 unrouted)
  Top 0.22: 74.3,7.14 73.82,7.14 73.82,4.45
  Top 0.406: U$13.1 76.16,13.21 78.11,11.27 78.11,7.94 77.31,7.14 74.3,7.14 | 73.82,4.45 73.82,4.29 73.34,3.81 70.64,3.81 68.26,6.19 68.26,9.84 68.9,10.48 68.9,14.13 68.9,14.29 67.94,15.24 58.58,15.24 58.58,29.62
N$32  (1 unrouted)
  Top 0.406: R11.2 69.69,14.76 68.1,16.35 59.69,16.35 59.37,16.67 59.37,30.42
N$33
  Top 0.406: R4.1 U$17.B
N$34  (1 unrouted)
  Top 0.406: U$16.C 15.4,34.77 R5.2
N$35
  Top 0.406: U$16.B 27.31,33.82 R6.1
N$36
  Top 0.406: R11.1 72.72,8.08 U$2.B
N$38  (2 unrouted)
N$39  (1 unrouted)
N$40  (via drill 0.6)
  Top 0.406: JP2.3 36.51,21.27 37.31,21.27 39.37,21.27 40.01,21.91 42.23,24.13 IC1.17 | JP2.3
  other vias: 36.51,22.7
N$41  (1 unrouted)
N$42  (via drill 0.6)
  Top 0.406: JP2.5 | 33.97,20.32 33.97,20.95 JP2.5 | 35.24,19.05 33.97,20.32 | 35.24,19.05 R31.1 | JP2.5 | 33.97,20.32 JP2.5 | 35.24,19.05 35.24,18.1 v35.24,16.51 | IC1.29 53.66,28.82 53.66,28.73 53.82,28.73 55.56,27.62 | v55.56,26.83 55.56,26.67
  Top 2.184: v35.24,16.51 34.45,16.51
  Top 2.54: 55.56,26.67 55.56,27.62
  Bottom 0.406: v55.56,26.83 48.58,20.32 40.64,20.32 v35.24,16.51
  other vias: 33.97,22.7
N$43  (2 unrouted)
N$44  (2 unrouted)
N$45  (1 unrouted)
N$46  (2 unrouted)
N$47  (1 unrouted)
N$48  (1 unrouted)
N$49  (2 unrouted)
N$50  (2 unrouted)
N$52  (2 unrouted)
N$53  (1 unrouted)
N$54  (2 unrouted)
N$55  (1 unrouted)
N$56  (2 unrouted)
N$57  (1 unrouted)
N$58  (1 unrouted)
N$59  (1 unrouted)
N$60  (2 unrouted)
N$61  (1 unrouted)
N$62  (2 unrouted)
N$63  (1 unrouted)
N$64  (1 unrouted)
N$65  (1 unrouted)
N$66  (4 unrouted)
N$67  (4 unrouted)
N$68  (4 unrouted)
N$69  (3 unrouted)
N$70  (2 unrouted)
N$71  (1 unrouted)
N$72  (1 unrouted)
N$73  (1 unrouted)
N$74  (1 unrouted)
N$75  (1 unrouted)
N$78  (1 unrouted)
VCC  (4 unrouted)
  Top 1.676: U$5.3 96.52,30.48
  Top 1.778: U$3.3 U$4.3 | U$4.3 U$5.3 | 97.95,20.16 U$4.3
  Top 1.93: 97.95,20.16 97.95,11.59 U$3.3 | 96.52,30.48 97.79,29.21 97.79,20.48 97.95,20.32 97.95,28.89 96.52,30.32 | U$4.3
VDD
  Top 0.22: 60.8,4.6 | 60.8,4.6 63.5,4.6 | 60.8,4.6 60.64,4.76 | 56.36,4.6 59.05,4.6
  Top 0.406: R25.1 64.45,4.61 64.45,4.6 63.5,4.6 | 60.8,4.6 60.64,4.76 | 60.17,5.24 60.8,4.6 | 60.17,5.24 R26.1 | R26.1 | R26.1 R27.1 R26.1 | R26.1 | R26.1 | 60.17,4.6 60.17,5.24 | R26.1 | 60.17,4.6 60.8,4.6 | 59.05,4.6 60.17,4.6 | IC1.25 50.65,25.55 50.64,11.43 50.64,10.32 51.59,9.37 54.29,9.37 54.29,7.3 56.36,5.24 56.36,4.6
VEE
  Top 0.406: R13.1 R25.2 R21.2 C2.1 67.63,10.8 67.94,11.11 67.94,13.97 67.47,14.45 57.78,14.45 57.78,24.29 53.02,24.29 53.02,27.78 52.7,27.94 50.25,27.94
VPP
  Top 0.22: 57.63,11.43 57.31,11.75 52.39,11.75
  Top 0.406: R14.1 R26.2 62.07,10.01 R20.2 C3.1 58.26,10.8 57.63,11.43 | 52.39,11.75 52.23,11.75 52.23,27.15 50.24,27.15
VSS
  Top 0.406: R15.1 57.15,5.55 56.04,6.67 56.04,7.94 R27.2 55.88,10.8 | 55.88,10.8 R19.2 | 55.88,10.8 53.97,10.8 C4.1 52.23,10.8 51.44,10.79 51.44,26.35 50.27,26.35 IC1.26